# Altium schematic sheet [3] F2838 GPIO.SchDoc
size 431 x 279 mm; DocumentNumber: 4; SheetNumber: 4; SheetTotal: 9
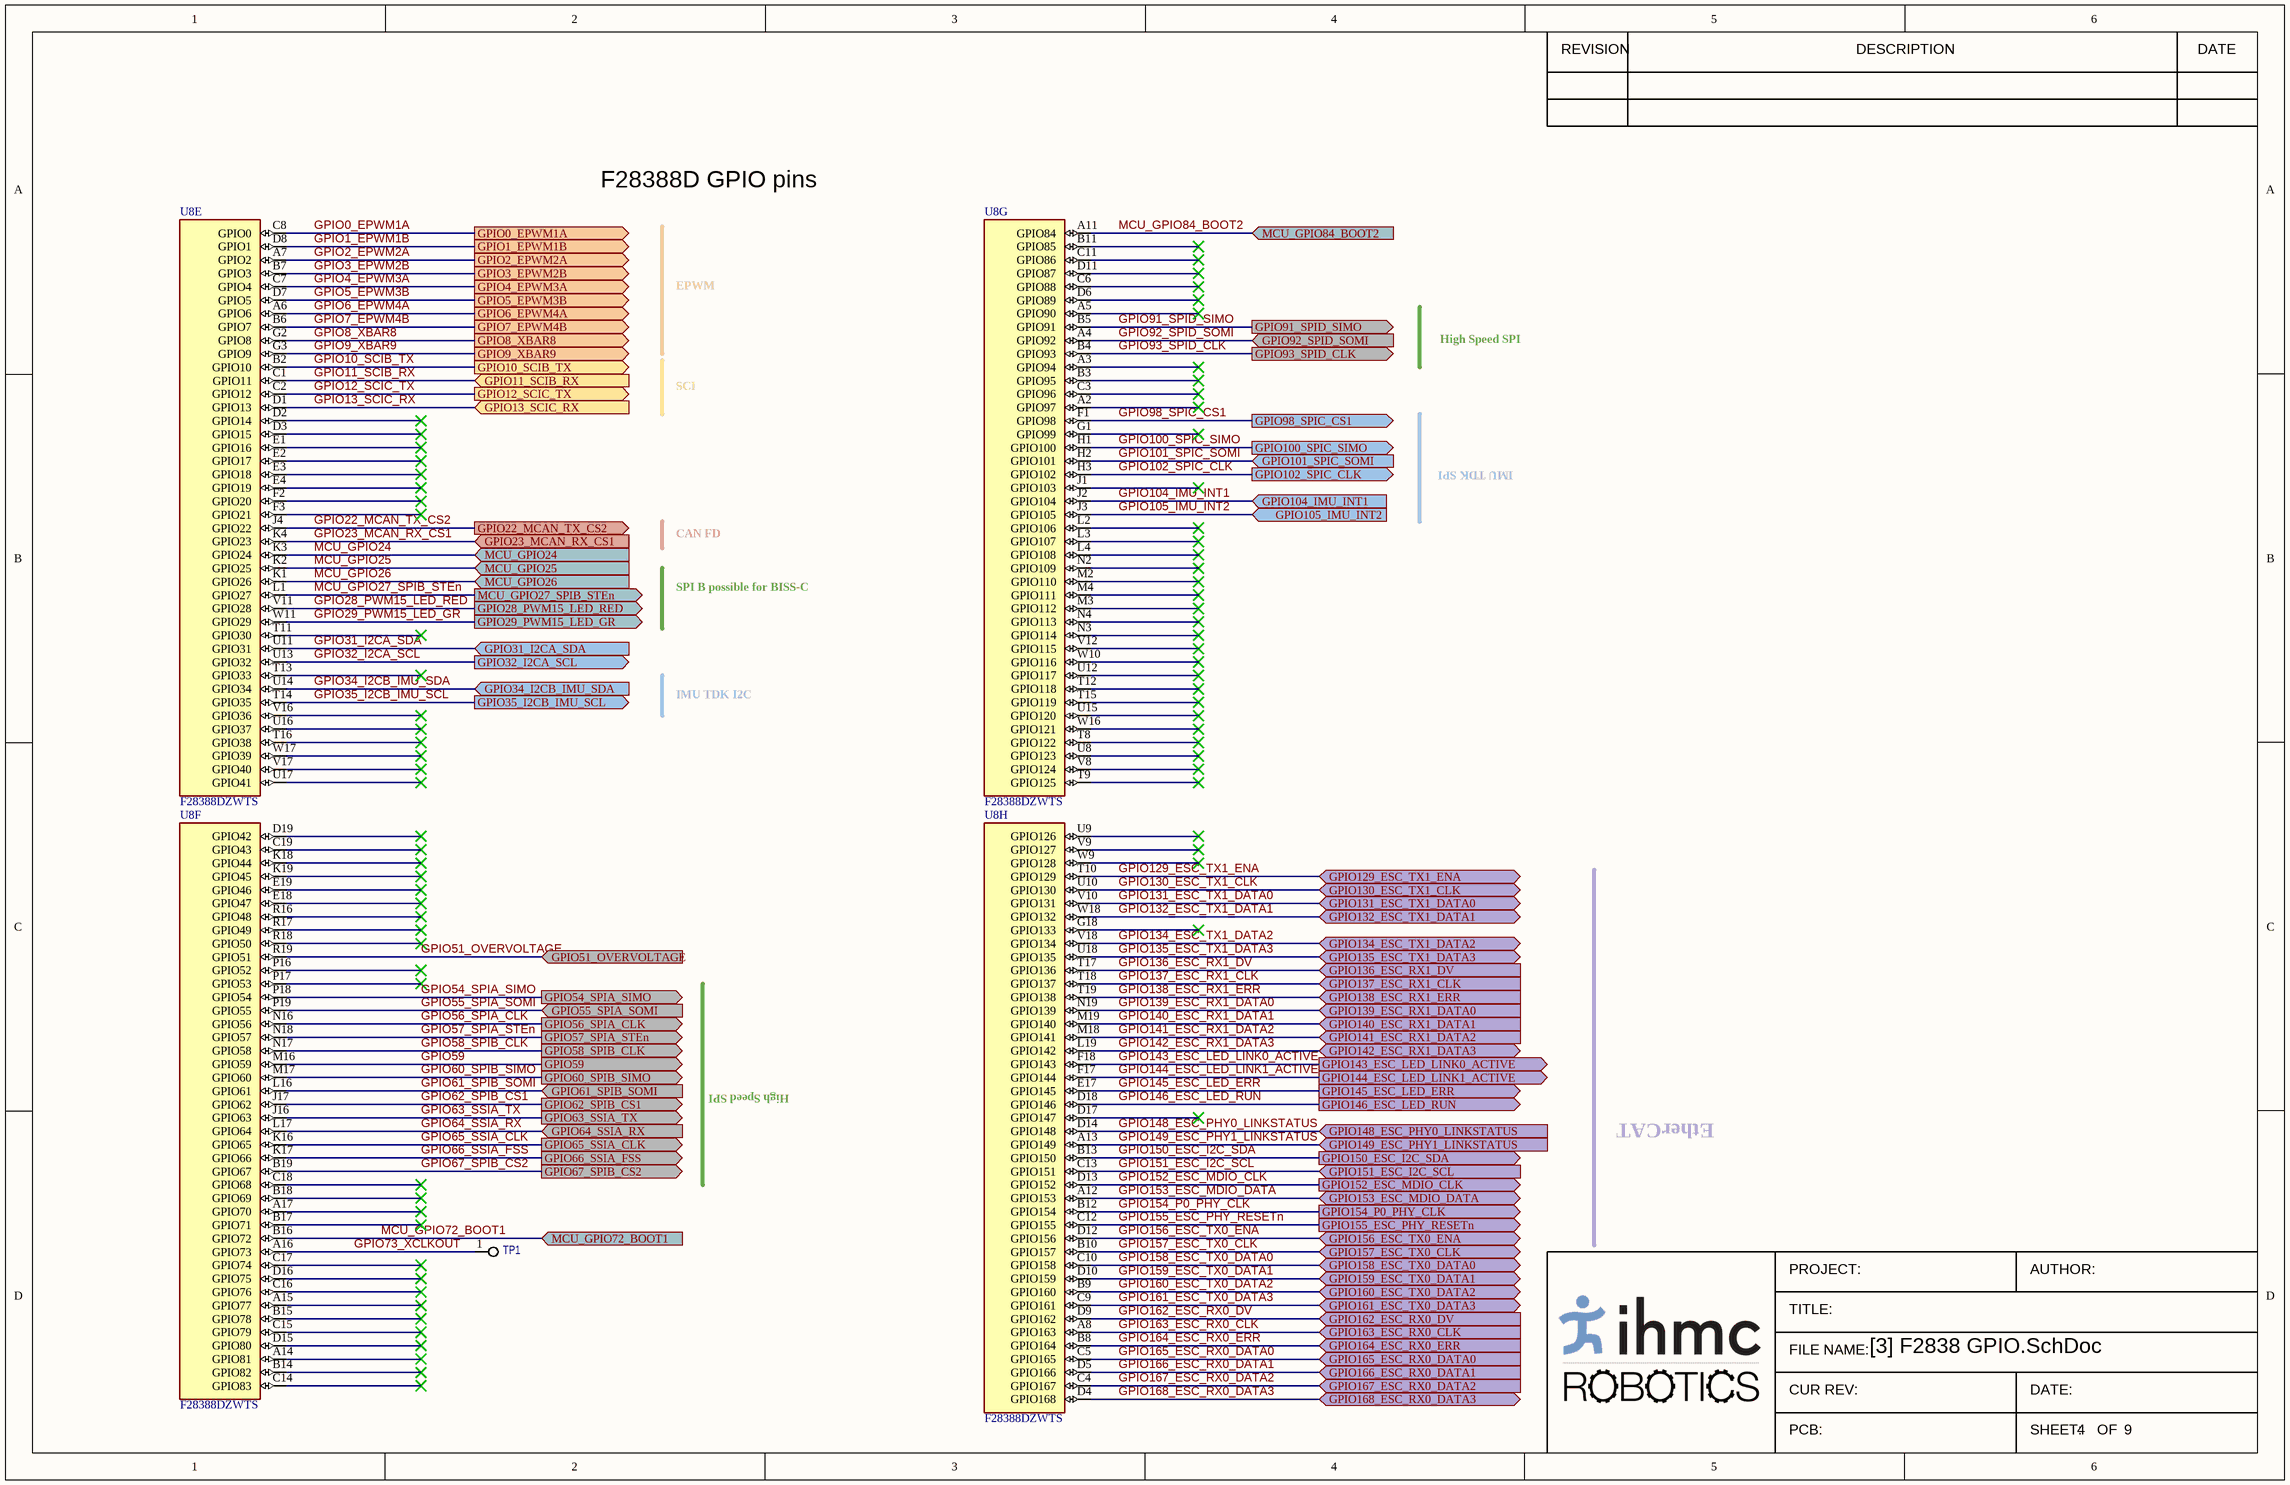
[diagram p0: [3] F2838 GPIO.SchDoc]

## Parts
TP1  TP_SMD  [Pad_1mm]  (value not drawn)  (no BOM)
U8  F28388DZWTS  [FP-ZWT0337A-IPC_B - ESNACK]  (parts E,F,G,H of 8)

## Ports
GPIO0_EPWM1A (out), GPIO1_EPWM1B (out), GPIO2_EPWM2A (out), GPIO3_EPWM2B (out), GPIO4_EPWM3A (out), GPIO5_EPWM3B (out), GPIO6_EPWM4A (out), GPIO7_EPWM4B (out), GPIO8_XBAR8 (out), GPIO9_XBAR9 (out), GPIO10_SCIB_TX (out), GPIO11_SCIB_RX (in), GPIO12_SCIC_TX (out), GPIO13_SCIC_RX (in), GPIO22_MCAN_TX_CS2 (out), GPIO23_MCAN_RX_CS1 (in), GPIO28_PWM15_LED_RED (out), GPIO29_PWM15_LED_GR (out), GPIO31_I2CA_SDA (in), GPIO32_I2CA_SCL (out), GPIO34_I2CB_IMU_SDA (in), GPIO35_I2CB_IMU_SCL (out), GPIO51_OVERVOLTAGE (in), GPIO54_SPIA_SIMO (out), GPIO55_SPIA_SOMI (in), GPIO56_SPIA_CLK (out), GPIO57_SPIA_STEn (out), GPIO58_SPIB_CLK (out), GPIO59 (out), GPIO60_SPIB_SIMO (out), GPIO61_SPIB_SOMI (in), GPIO62_SPIB_CS1 (out), GPIO63_SSIA_TX (out), GPIO64_SSIA_RX (in), GPIO65_SSIA_CLK (out), GPIO66_SSIA_FSS (out), GPIO67_SPIB_CS2 (out), GPIO91_SPID_SIMO (out), GPIO92_SPID_SOMI (in), GPIO93_SPID_CLK (out), GPIO98_SPIC_CS1 (out), GPIO100_SPIC_SIMO (out), GPIO101_SPIC_SOMI (in), GPIO102_SPIC_CLK (out), GPIO104_IMU_INT1 (in), GPIO105_IMU_INT2 (in), GPIO129_ESC_TX1_ENA (bidir), GPIO130_ESC_TX1_CLK (bidir), GPIO131_ESC_TX1_DATA0 (bidir), GPIO132_ESC_TX1_DATA1 (bidir), GPIO134_ESC_TX1_DATA2 (bidir), GPIO135_ESC_TX1_DATA3 (bidir), GPIO136_ESC_RX1_DV (in), GPIO137_ESC_RX1_CLK (in), GPIO138_ESC_RX1_ERR (in), GPIO139_ESC_RX1_DATA0 (in), GPIO140_ESC_RX1_DATA1 (in), GPIO141_ESC_RX1_DATA2 (in), GPIO142_ESC_RX1_DATA3 (bidir), GPIO143_ESC_LED_LINK0_ACTIVE (out), GPIO144_ESC_LED_LINK1_ACTIVE (out), GPIO145_ESC_LED_ERR (out), GPIO146_ESC_LED_RUN (out), GPIO148_ESC_PHY0_LINKSTATUS (in), GPIO149_ESC_PHY1_LINKSTATUS (in), GPIO150_ESC_I2C_SDA (out), GPIO151_ESC_I2C_SCL (in), GPIO152_ESC_MDIO_CLK (out), GPIO153_ESC_MDIO_DATA (bidir), GPIO154_P0_PHY_CLK (out), GPIO155_ESC_PHY_RESETn (out), GPIO156_ESC_TX0_ENA (bidir), GPIO157_ESC_TX0_CLK (bidir), GPIO158_ESC_TX0_DATA0 (bidir), GPIO159_ESC_TX0_DATA1 (bidir), GPIO160_ESC_TX0_DATA2 (bidir), GPIO161_ESC_TX0_DATA3 (bidir), GPIO162_ESC_RX0_DV (in), GPIO163_ESC_RX0_CLK (in), GPIO164_ESC_RX0_ERR (in), GPIO165_ESC_RX0_DATA0 (in), GPIO166_ESC_RX0_DATA1 (in), GPIO167_ESC_RX0_DATA2 (in), GPIO168_ESC_RX0_DATA3 (bidir), MCU_GPIO24 (in), MCU_GPIO25 (in), MCU_GPIO26 (in), MCU_GPIO27_SPIB_STEn (out), MCU_GPIO72_BOOT1 (in), MCU_GPIO84_BOOT2 (in)

## Nets
GPIO0_EPWM1A: U8.C8(GPIO0) ; port GPIO0_EPWM1A
GPIO1_EPWM1B: U8.D8(GPIO1) ; port GPIO1_EPWM1B
GPIO2_EPWM2A: U8.A7(GPIO2) ; port GPIO2_EPWM2A
GPIO3_EPWM2B: U8.B7(GPIO3) ; port GPIO3_EPWM2B
GPIO4_EPWM3A: U8.C7(GPIO4) ; port GPIO4_EPWM3A
GPIO5_EPWM3B: U8.D7(GPIO5) ; port GPIO5_EPWM3B
GPIO6_EPWM4A: U8.A6(GPIO6) ; port GPIO6_EPWM4A
GPIO7_EPWM4B: U8.B6(GPIO7) ; port GPIO7_EPWM4B
GPIO8_XBAR8: U8.G2(GPIO8) ; port GPIO8_XBAR8
GPIO9_XBAR9: U8.G3(GPIO9) ; port GPIO9_XBAR9
GPIO10_SCIB_TX: U8.B2(GPIO10) ; port GPIO10_SCIB_TX
GPIO11_SCIB_RX: U8.C1(GPIO11) ; port GPIO11_SCIB_RX
GPIO12_SCIC_TX: U8.C2(GPIO12) ; port GPIO12_SCIC_TX
GPIO13_SCIC_RX: U8.D1(GPIO13) ; port GPIO13_SCIC_RX
GPIO22_MCAN_TX_CS2: U8.J4(GPIO22) ; port GPIO22_MCAN_TX_CS2
GPIO23_MCAN_RX_CS1: U8.K4(GPIO23) ; port GPIO23_MCAN_RX_CS1
GPIO28_PWM15_LED_RED: U8.V11(GPIO28) ; port GPIO28_PWM15_LED_RED
GPIO29_PWM15_LED_GR: U8.W11(GPIO29) ; port GPIO29_PWM15_LED_GR
GPIO31_I2CA_SDA: U8.U11(GPIO31) ; port GPIO31_I2CA_SDA
GPIO32_I2CA_SCL: U8.U13(GPIO32) ; port GPIO32_I2CA_SCL
GPIO34_I2CB_IMU_SDA: U8.U14(GPIO34) ; port GPIO34_I2CB_IMU_SDA
GPIO35_I2CB_IMU_SCL: U8.T14(GPIO35) ; port GPIO35_I2CB_IMU_SCL
GPIO51_OVERVOLTAGE: U8.R19(GPIO51) ; port GPIO51_OVERVOLTAGE
GPIO54_SPIA_SIMO: U8.P18(GPIO54) ; port GPIO54_SPIA_SIMO
GPIO55_SPIA_SOMI: U8.P19(GPIO55) ; port GPIO55_SPIA_SOMI
GPIO56_SPIA_CLK: U8.N16(GPIO56) ; port GPIO56_SPIA_CLK
GPIO57_SPIA_STEn: U8.N18(GPIO57) ; port GPIO57_SPIA_STEn
GPIO58_SPIB_CLK: U8.N17(GPIO58) ; port GPIO58_SPIB_CLK
GPIO59: U8.M16(GPIO59) ; port GPIO59
GPIO60_SPIB_SIMO: U8.M17(GPIO60) ; port GPIO60_SPIB_SIMO
GPIO61_SPIB_SOMI: U8.L16(GPIO61) ; port GPIO61_SPIB_SOMI
GPIO62_SPIB_CS1: U8.J17(GPIO62) ; port GPIO62_SPIB_CS1
GPIO63_SSIA_TX: U8.J16(GPIO63) ; port GPIO63_SSIA_TX
GPIO64_SSIA_RX: U8.L17(GPIO64) ; port GPIO64_SSIA_RX
GPIO65_SSIA_CLK: U8.K16(GPIO65) ; port GPIO65_SSIA_CLK
GPIO66_SSIA_FSS: U8.K17(GPIO66) ; port GPIO66_SSIA_FSS
GPIO67_SPIB_CS2: U8.B19(GPIO67) ; port GPIO67_SPIB_CS2
GPIO73_XCLKOUT: TP1.1(IN) U8.A16(GPIO73)
GPIO91_SPID_SIMO: U8.B5(GPIO91) ; port GPIO91_SPID_SIMO
GPIO92_SPID_SOMI: U8.A4(GPIO92) ; port GPIO92_SPID_SOMI
GPIO93_SPID_CLK: U8.B4(GPIO93) ; port GPIO93_SPID_CLK
GPIO98_SPIC_CS1: U8.F1(GPIO98) ; port GPIO98_SPIC_CS1
GPIO100_SPIC_SIMO: U8.H1(GPIO100) ; port GPIO100_SPIC_SIMO
GPIO101_SPIC_SOMI: U8.H2(GPIO101) ; port GPIO101_SPIC_SOMI
GPIO102_SPIC_CLK: U8.H3(GPIO102) ; port GPIO102_SPIC_CLK
GPIO104_IMU_INT1: U8.J2(GPIO104) ; port GPIO104_IMU_INT1
GPIO105_IMU_INT2: U8.J3(GPIO105) ; port GPIO105_IMU_INT2
GPIO129_ESC_TX1_ENA: U8.T10(GPIO129) ; port GPIO129_ESC_TX1_ENA
GPIO130_ESC_TX1_CLK: U8.U10(GPIO130) ; port GPIO130_ESC_TX1_CLK
GPIO131_ESC_TX1_DATA0: U8.V10(GPIO131) ; port GPIO131_ESC_TX1_DATA0
GPIO132_ESC_TX1_DATA1: U8.W18(GPIO132) ; port GPIO132_ESC_TX1_DATA1
GPIO134_ESC_TX1_DATA2: U8.V18(GPIO134) ; port GPIO134_ESC_TX1_DATA2
GPIO135_ESC_TX1_DATA3: U8.U18(GPIO135) ; port GPIO135_ESC_TX1_DATA3
GPIO136_ESC_RX1_DV: U8.T17(GPIO136) ; port GPIO136_ESC_RX1_DV
GPIO137_ESC_RX1_CLK: U8.T18(GPIO137) ; port GPIO137_ESC_RX1_CLK
GPIO138_ESC_RX1_ERR: U8.T19(GPIO138) ; port GPIO138_ESC_RX1_ERR
GPIO139_ESC_RX1_DATA0: U8.N19(GPIO139) ; port GPIO139_ESC_RX1_DATA0
GPIO140_ESC_RX1_DATA1: U8.M19(GPIO140) ; port GPIO140_ESC_RX1_DATA1
GPIO141_ESC_RX1_DATA2: U8.M18(GPIO141) ; port GPIO141_ESC_RX1_DATA2
GPIO142_ESC_RX1_DATA3: U8.L19(GPIO142) ; port GPIO142_ESC_RX1_DATA3
GPIO143_ESC_LED_LINK0_ACTIVE: U8.F18(GPIO143) ; port GPIO143_ESC_LED_LINK0_ACTIVE
GPIO144_ESC_LED_LINK1_ACTIVE: U8.F17(GPIO144) ; port GPIO144_ESC_LED_LINK1_ACTIVE
GPIO145_ESC_LED_ERR: U8.E17(GPIO145) ; port GPIO145_ESC_LED_ERR
GPIO146_ESC_LED_RUN: U8.D18(GPIO146) ; port GPIO146_ESC_LED_RUN
GPIO148_ESC_PHY0_LINKSTATUS: U8.D14(GPIO148) ; port GPIO148_ESC_PHY0_LINKSTATUS
GPIO149_ESC_PHY1_LINKSTATUS: U8.A13(GPIO149) ; port GPIO149_ESC_PHY1_LINKSTATUS
GPIO150_ESC_I2C_SDA: U8.B13(GPIO150) ; port GPIO150_ESC_I2C_SDA
GPIO151_ESC_I2C_SCL: U8.C13(GPIO151) ; port GPIO151_ESC_I2C_SCL
GPIO152_ESC_MDIO_CLK: U8.D13(GPIO152) ; port GPIO152_ESC_MDIO_CLK
GPIO153_ESC_MDIO_DATA: U8.A12(GPIO153) ; port GPIO153_ESC_MDIO_DATA
GPIO154_P0_PHY_CLK: U8.B12(GPIO154) ; port GPIO154_P0_PHY_CLK
GPIO155_ESC_PHY_RESETn: U8.C12(GPIO155) ; port GPIO155_ESC_PHY_RESETn
GPIO156_ESC_TX0_ENA: U8.D12(GPIO156) ; port GPIO156_ESC_TX0_ENA
GPIO157_ESC_TX0_CLK: U8.B10(GPIO157) ; port GPIO157_ESC_TX0_CLK
GPIO158_ESC_TX0_DATA0: U8.C10(GPIO158) ; port GPIO158_ESC_TX0_DATA0
GPIO159_ESC_TX0_DATA1: U8.D10(GPIO159) ; port GPIO159_ESC_TX0_DATA1
GPIO160_ESC_TX0_DATA2: U8.B9(GPIO160) ; port GPIO160_ESC_TX0_DATA2
GPIO161_ESC_TX0_DATA3: U8.C9(GPIO161) ; port GPIO161_ESC_TX0_DATA3
GPIO162_ESC_RX0_DV: U8.D9(GPIO162) ; port GPIO162_ESC_RX0_DV
GPIO163_ESC_RX0_CLK: U8.A8(GPIO163) ; port GPIO163_ESC_RX0_CLK
GPIO164_ESC_RX0_ERR: U8.B8(GPIO164) ; port GPIO164_ESC_RX0_ERR
GPIO165_ESC_RX0_DATA0: U8.C5(GPIO165) ; port GPIO165_ESC_RX0_DATA0
GPIO166_ESC_RX0_DATA1: U8.D5(GPIO166) ; port GPIO166_ESC_RX0_DATA1
GPIO167_ESC_RX0_DATA2: U8.C4(GPIO167) ; port GPIO167_ESC_RX0_DATA2
GPIO168_ESC_RX0_DATA3: U8.D4(GPIO168) ; port GPIO168_ESC_RX0_DATA3
MCU_GPIO24: U8.K3(GPIO24) ; port MCU_GPIO24
MCU_GPIO25: U8.K2(GPIO25) ; port MCU_GPIO25
MCU_GPIO26: U8.K1(GPIO26) ; port MCU_GPIO26
MCU_GPIO27_SPIB_STEn: U8.L1(GPIO27) ; port MCU_GPIO27_SPIB_STEn
MCU_GPIO72_BOOT1: U8.B16(GPIO72) ; port MCU_GPIO72_BOOT1
MCU_GPIO84_BOOT2: U8.A11(GPIO84) ; port MCU_GPIO84_BOOT2

Not connected (* = marked no-connect by the designer): U8 A2(GPIO97)* A3(GPIO94)* A5(GPIO90)* A14(GPIO81)* A15(GPIO77)* A17(GPIO70)* B3(GPIO95)* B11(GPIO85)* B14(GPIO82)* B15(GPIO78)* B17(GPIO71)* B18(GPIO69)* C3(GPIO96)* C6(GPIO88)* C11(GPIO86)* C14(GPIO83)* C15(GPIO79)* C16(GPIO76)* C17(GPIO74)* C18(GPIO68)* C19(GPIO43)* D2(GPIO14)* D3(GPIO15)* D6(GPIO89)* D11(GPIO87)* D15(GPIO80)* D16(GPIO75)* D17(GPIO147)* D19(GPIO42)* E1(GPIO16)* E2(GPIO17)* E3(GPIO18)* E4(GPIO19)* E18(GPIO47)* E19(GPIO46)* F2(GPIO20)* F3(GPIO21)* G1(GPIO99)* G18(GPIO133)* J1(GPIO103)* K18(GPIO44)* K19(GPIO45)* L2(GPIO106)* L3(GPIO107)* L4(GPIO108)* M2(GPIO110)* M3(GPIO112)* M4(GPIO111)* N2(GPIO109)* N3(GPIO114)* N4(GPIO113)* P16(GPIO52)* P17(GPIO53)* R16(GPIO48)* R17(GPIO49)* R18(GPIO50)* T8(GPIO122)* T9(GPIO125)* T11(GPIO30)* T12(GPIO118)* T13(GPIO33)* T15(GPIO119)* T16(GPIO38)* U8(GPIO123)* U9(GPIO126)* U12(GPIO117)* U15(GPIO120)* U16(GPIO37)* U17(GPIO41)* V8(GPIO124)* V9(GPIO127)* V12(GPIO115)* V16(GPIO36)* V17(GPIO40)* W9(GPIO128)* W10(GPIO116)* W16(GPIO121)* W17(GPIO39)*

## Notes on the sheet
- F28388D GPIO pins
- EPWM
- High Speed SPI
- SCI
- IMU TDK SPI
- CAN FD
- SPI B possible for BISS-C
- IMU TDK I2C
- EtherCAT
- REVISION
- DESCRIPTION
- DATE
- PROJECT:
- AUTHOR:
- TITLE:
- FILE NAME:
- CUR REV:
- PCB:
- SHEET:
- DATE:
- OF

## Library data of the parts
TP1 = TP_SMD_1MM: Test point SMD
U8 = TMS320F28388D_32bit_uC: 32-bit MCU with connectivity manager, 2x C28x+CLA CPU, 1.5 MB flash, FPU64, CLB, Ethernet, EtherCAT 337-NFBGA -40 to +125; Manufacturer: Texas instruments; Standoff Height: 0.35mm; Number Of Usb Channels: 1; Max Junction Temp: +125°C; Data Bus Width: 32bits; Number Of I/Os: 169; Number Of A/D Converters: 4; Number Of Cores: 2; Number Of Uart Channels: 5; Min Supply Voltage: 1.14V; Memory Size: 1.5MBytes; Interface: I2C,SPI,UART,EBI/EMI,CAN,USB,SCI,IrDA,Ethernet,I2S,SMBus,LVCMOS,Other; Number Of Timers/Counters: 6; Number Of Adc Channels: 24; Ram Size: 312KBytes; Max Supply Voltage: 3.47V; Frequency: 200MHz; Core Architecture: C28x; Number Of Pwm Channels: 32; Number Of I2C Channels: 3; Device Class L1: Integrated Circuits (ICs); Category: IC; ComponentLink2URL: http://www.ti.com/lit/ds/symlink/tms320f28388s.pdf; Number Of Ethernet Channels: 1; Memory Type: FLASH; Device Class L2: Embedded Processors and Controllers; ComponentLink2Description: Datasheet; Package: ZWT0337A; Temperature Range Low: -40°C; RoHS: TRUE; Lead Free: Yes; Device Class L3: Microcontrollers; Automotive: No; Height: 1.4mm; Ambient Temperature Range Low: -40°C; Ipc Land Pattern Name: BGA361N80P19X19_1600X1600X140; Number Of Spi Channels: 4; Ambient Temperature Range High: +125°C; Octopart: https://octopart.com/f28388dzwts-texas+instruments-102550657; Manufacturer Part Number: F28388DZWTS; Temperature Range High: +125°C; Temperature: -40°C to +125°C